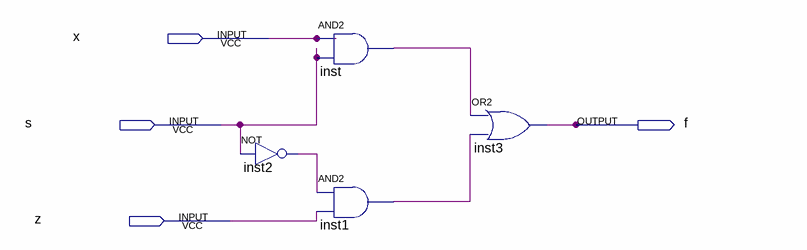
[diagram p0: schematic sheet]
// Quartus schematic Part_I.bdf as structural Verilog: 4 symbols, 4 pins
module Part_I (
  input  x,
  input  s,
  input  z,
  output f
);

  wire inst1_out, inst2_out, inst_out;

  not inst2 (inst2_out, s);
  and inst (inst_out, x, s);
  and inst1 (inst1_out, inst2_out, z);
  or inst3 (f, inst_out, inst1_out);
endmodule
